# EAGLE design SG_CAN_Board_2018 (EAGLE 8.3.2)
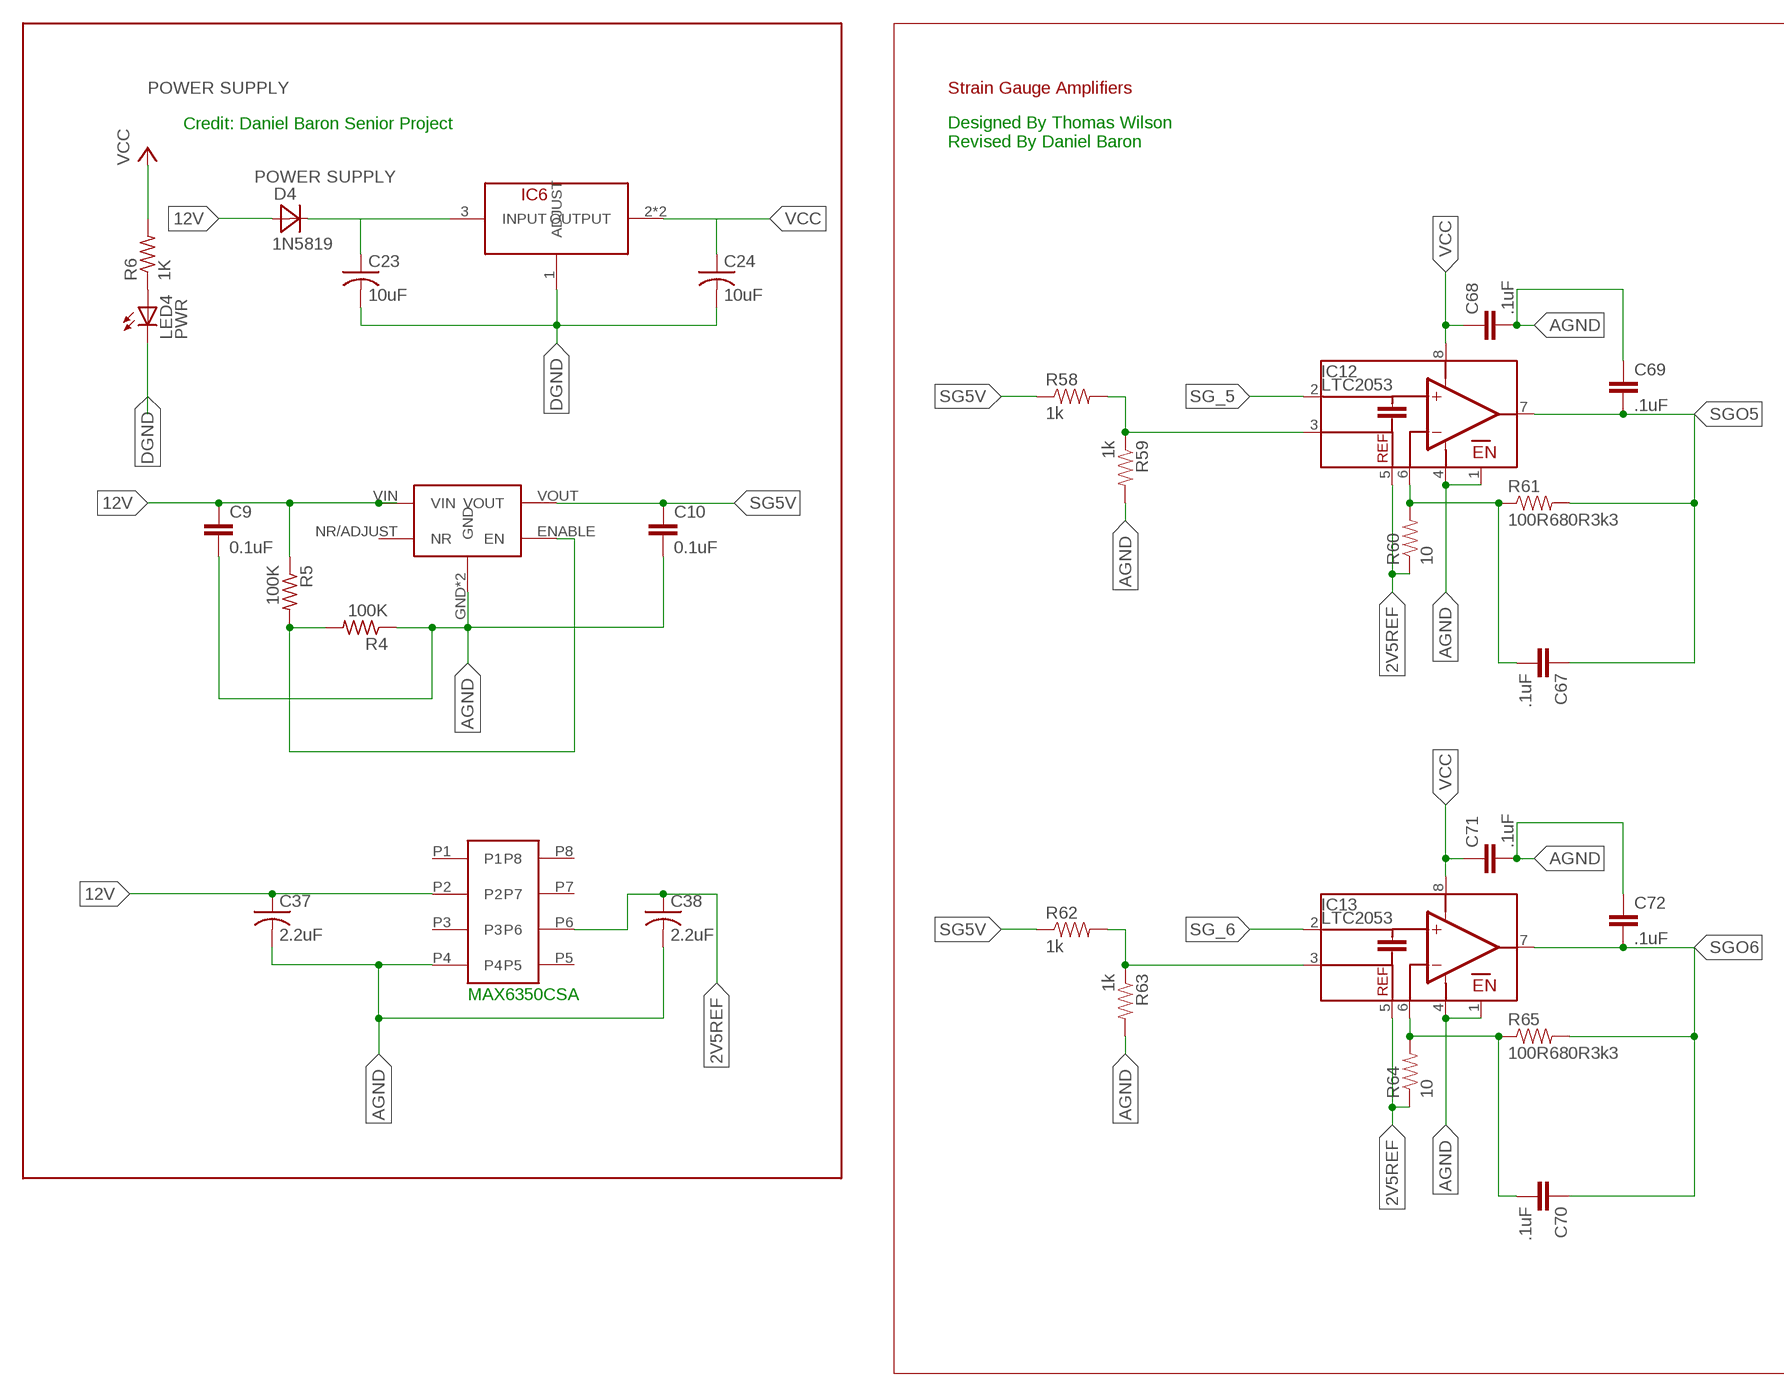
[diagram p0: schematic, sheet 1, part 1 of 2]
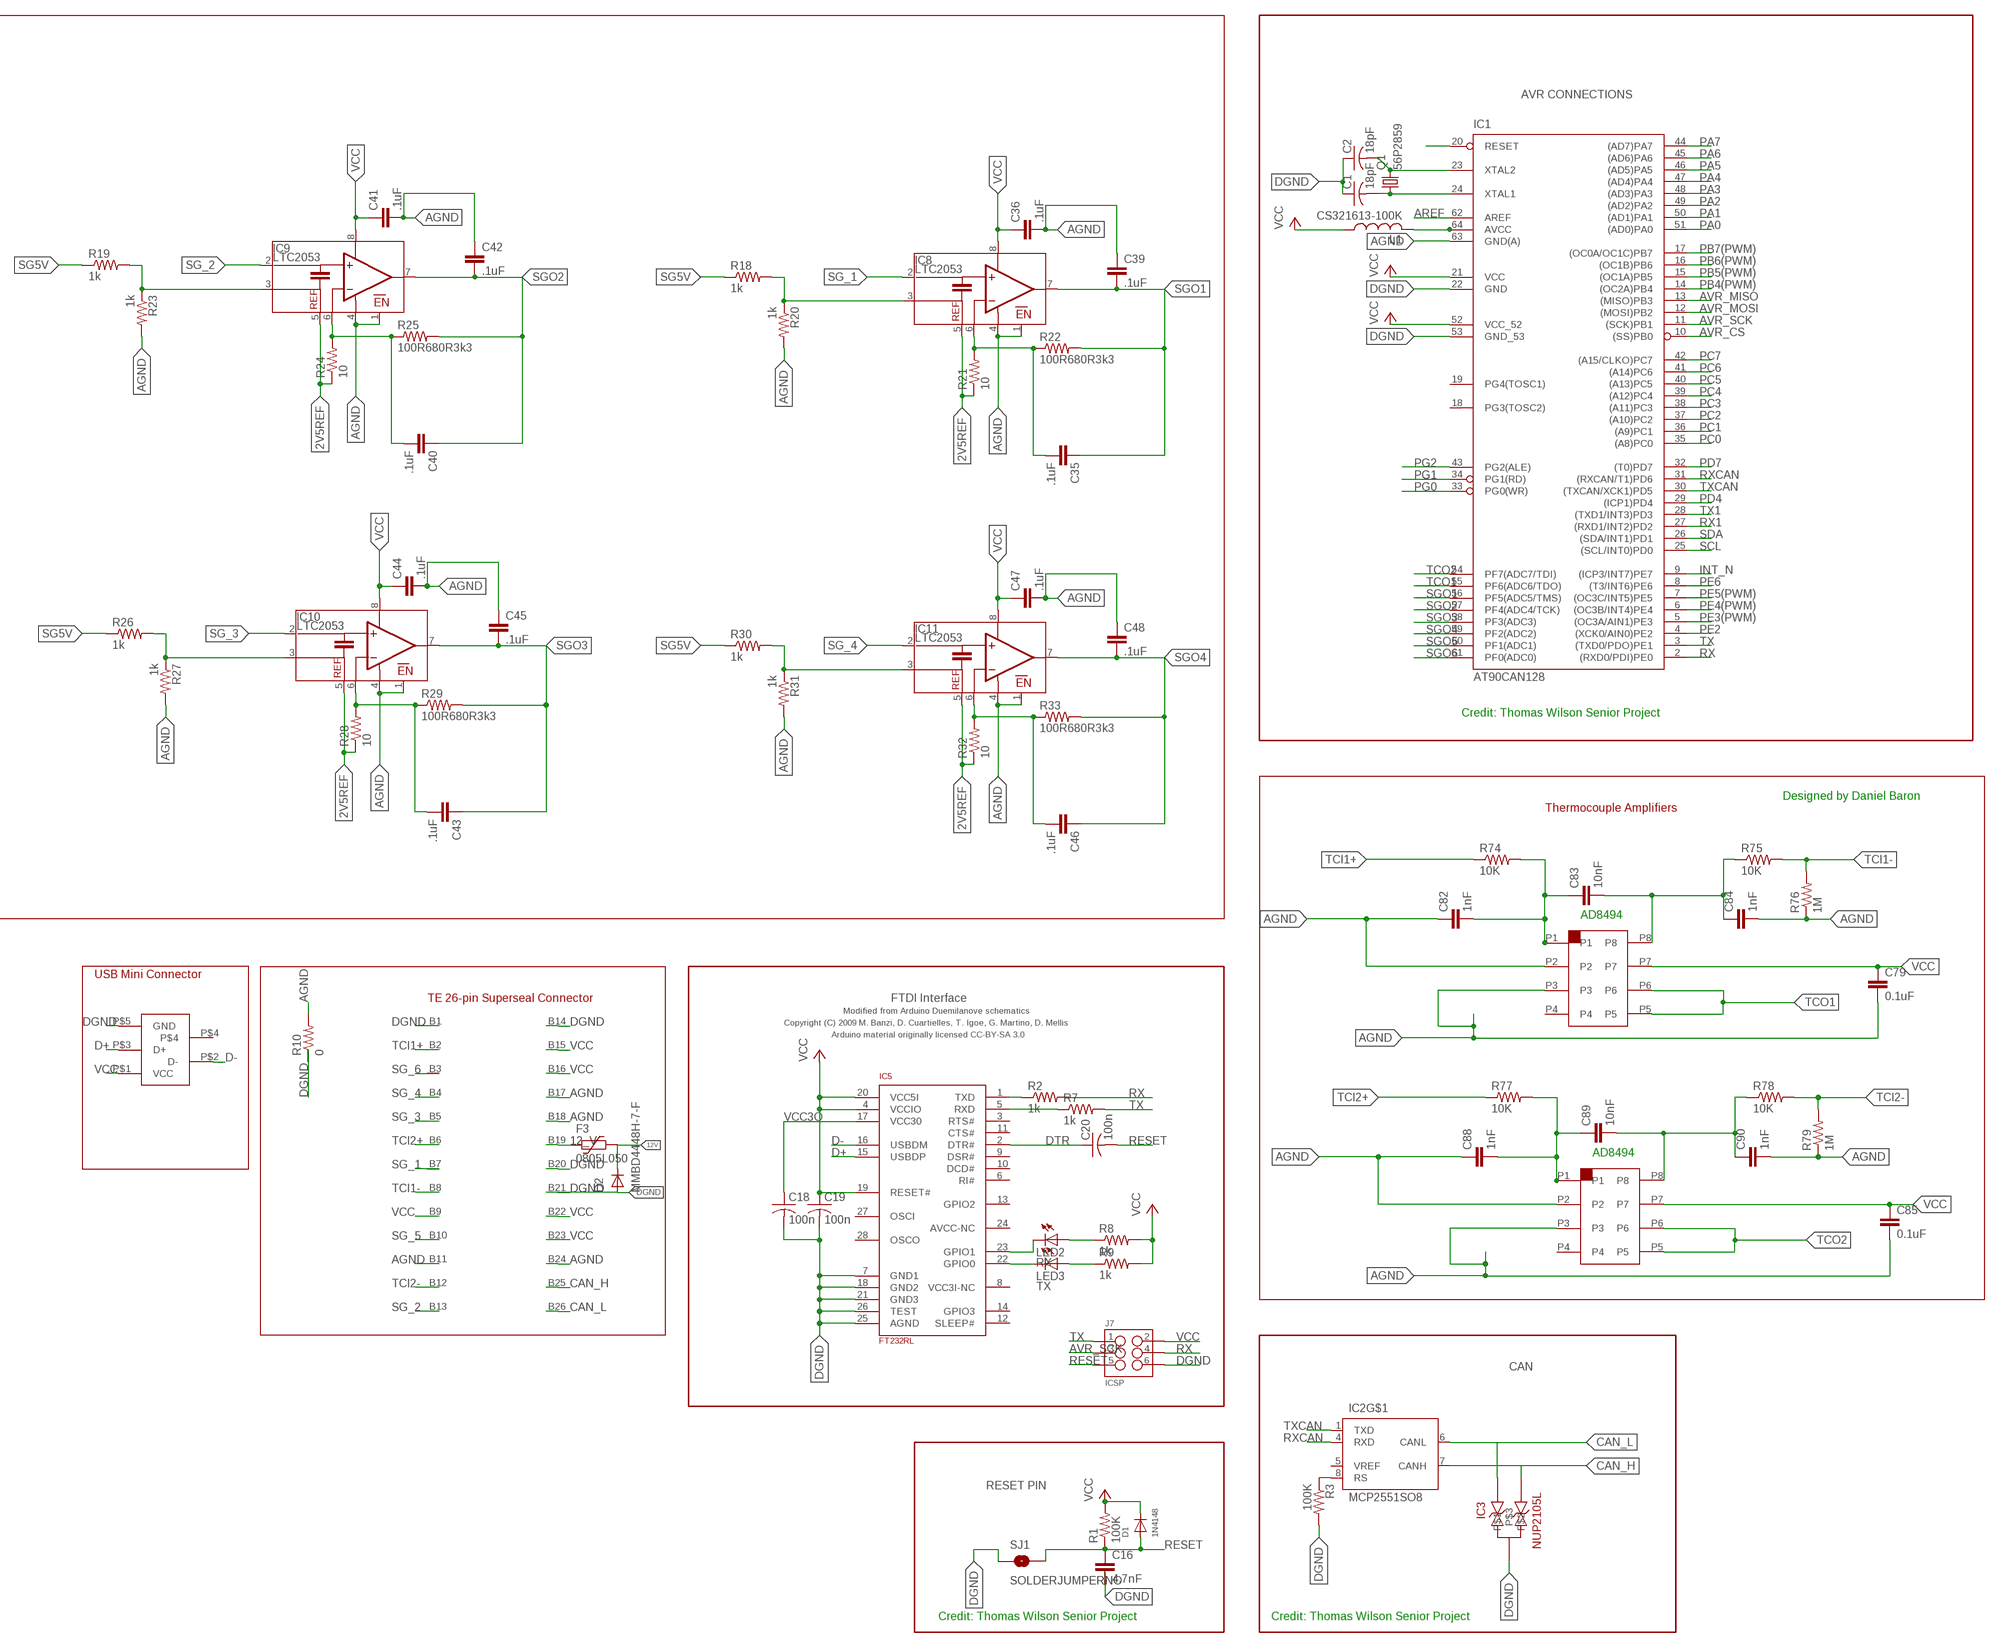
[diagram p1: schematic, sheet 1, part 2 of 2]

## Parts
C1  18pF  C-USC0805  [C0805]
C2  18pF  C-USC0805  [C0805]
C9  0.1uF  C-EUC0603  [C0603]
C10  0.1uF  C-EUC0603  [C0603]
C16  4.7nF  CAP0603-CAP  [0603-CAP]
C18  100n  C-USC0805  [C0805]
C19  100n  C-USC0805  [C0805]
C20  100n  C-USC0805  [C0805]
C23  10uF  C-USC0603  [C0603]
C24  10uF  C-USC0603  [C0603]
C35  .1uF  CAP0603-CAP  [0603-CAP]
C36  .1uF  CAP0603-CAP  [0603-CAP]
C37  2.2uF  C-USC0603  [C0603]
C38  2.2uF  C-USC0603  [C0603]
C39  .1uF  CAP0603-CAP  [0603-CAP]
C40  .1uF  CAP0603-CAP  [0603-CAP]
C41  .1uF  CAP0603-CAP  [0603-CAP]
C42  .1uF  CAP0603-CAP  [0603-CAP]
C43  .1uF  CAP0603-CAP  [0603-CAP]
C44  .1uF  CAP0603-CAP  [0603-CAP]
C45  .1uF  CAP0603-CAP  [0603-CAP]
C46  .1uF  CAP0603-CAP  [0603-CAP]
C47  .1uF  CAP0603-CAP  [0603-CAP]
C48  .1uF  CAP0603-CAP  [0603-CAP]
C67  .1uF  CAP0603-CAP  [0603-CAP]
C68  .1uF  CAP0603-CAP  [0603-CAP]
C69  .1uF  CAP0603-CAP  [0603-CAP]
C70  .1uF  CAP0603-CAP  [0603-CAP]
C71  .1uF  CAP0603-CAP  [0603-CAP]
C72  .1uF  CAP0603-CAP  [0603-CAP]
C79  0.1uF  C-EUC0603  [C0603]
C82  1nF  C-EUC0603  [C0603]
C83  10nF  C-EUC0603  [C0603]
C84  1nF  C-EUC0603  [C0603]
C85  0.1uF  C-EUC0603  [C0603]
C88  1nF  C-EUC0603  [C0603]
C89  10nF  C-EUC0603  [C0603]
C90  1nF  C-EUC0603  [C0603]
D1  1N4148  DIODESOD-123  [SOD-123]
D2  MMBD4448H-7-F  [SOT23-3]
D4  1N5819  [1N5819SM]
F3  0805L050  [0805L]
IC1  AT90CAN128  [TQFP64]
IC2  MCP2551SO8  [SO08]
IC3  NUP2105L  [SOT-23]
IC4  MAX6350CSA  [8-SOIC]
IC5  FT232RL  [SSOP28]
IC6  NCP1117  [SOT-223-4]
IC7  REG-104GA-5  [REG104GA-5]
IC8  LTC2053  [MSOP8]
IC9  LTC2053  [MSOP8]
IC10  LTC2053  [MSOP8]
IC11  LTC2053  [MSOP8]
IC12  LTC2053  [MSOP8]
IC13  LTC2053  [MSOP8]
IC15  AD8495  [8MSOP]
IC16  AD8495  [8MSOP]
J1  1734753-1_MINIUSB_CON  [1734753-1_MINIUSB_CON]
J2  SUPERSEAL1.0_26POS  [SUPERSEAL1.0_26POS]
J7  ICSP  M03X2SMD_FCI  [2X3_SMD_FCI_54202-G30]
L1  CS321613-100K  L-USL3216C  [L3216C]
LED2  RX  LEDCHIPLED_0805  [CHIPLED_0805]
LED3  TX  LEDCHIPLED_0805  [CHIPLED_0805]
LED4  PWR  LEDCHIPLED_0805  [CHIPLED_0805]
Q1  56P2859  CRYSTALSMD  [HC49UP]
R1  100K  R-US_R0805  [R0805]
R2  1k  R-US_R0805  [R0805]
R3  100K  R-US_R0805  [R0805]
R4  100K  R-US_M0805  [M0805]
R5  100K  R-US_M0805  [M0805]
R6  1K  R-US_R0805  [R0805]
R7  1k  R-US_R0805  [R0805]
R8  1k  R-US_R0805  [R0805]
R9  1k  R-US_R0805  [R0805]
R10  0  RESISTOR0603  [0603-RES]
R18  1k  RESISTOR0603  [0603-RES]
R19  1k  RESISTOR0603  [0603-RES]
R20  1k  RESISTOR0603  [0603-RES]
R21  10  RESISTOR0603  [0603-RES]
R22  100R680R3k3  RESISTOR0603  [0603-RES]
R23  1k  RESISTOR0603  [0603-RES]
R24  10  RESISTOR0603  [0603-RES]
R25  100R680R3k3  RESISTOR0603  [0603-RES]
R26  1k  RESISTOR0603  [0603-RES]
R27  1k  RESISTOR0603  [0603-RES]
R28  10  RESISTOR0603  [0603-RES]
R29  100R680R3k3  RESISTOR0603  [0603-RES]
R30  1k  RESISTOR0603  [0603-RES]
R31  1k  RESISTOR0603  [0603-RES]
R32  10  RESISTOR0603  [0603-RES]
R33  100R680R3k3  RESISTOR0603  [0603-RES]
R58  1k  RESISTOR0603  [0603-RES]
R59  1k  RESISTOR0603  [0603-RES]
R60  10  RESISTOR0603  [0603-RES]
R61  100R680R3k3  RESISTOR0603  [0603-RES]
R62  1k  RESISTOR0603  [0603-RES]
R63  1k  RESISTOR0603  [0603-RES]
R64  10  RESISTOR0603  [0603-RES]
R65  100R680R3k3  RESISTOR0603  [0603-RES]
R74  10K  RESISTOR0603  [0603-RES]
R75  10K  RESISTOR0603  [0603-RES]
R76  1M  RESISTOR0603  [0603-RES]
R77  10K  RESISTOR0603  [0603-RES]
R78  10K  RESISTOR0603  [0603-RES]
R79  1M  RESISTOR0603  [0603-RES]
SJ1  SOLDERJUMPERNO  [SJ_2S-NO]

## Nets
2V5REF: C38.1 IC4.P6 IC8.5(REF) IC9.5(REF) IC10.5(REF) IC11.5(REF) IC12.5(REF) IC13.5(REF) R21.1 R24.1 R28.1 R32.1 R60.1 R64.1
5V_REG_IN: C23.1 D4.P$2(C) IC6.3(INPUT)
12_V: F3.2 J2.B19
12V: C9.1 C37.1 D2.3(C) D4.P$1(A) F3.1 IC4.P2 IC7.VIN R5.1
AGND: C9.2 C10.2 C36.2 C37.2 C38.2 C39.1 C41.2 C42.1 C44.2 C45.1 C47.2 C48.1 C68.2 C69.1 C71.2 C72.1 C79.2 C82.1 C84.2 C85.2 C88.1 C90.2 IC1.63(GND(A)) IC4.P4 IC7.GND IC7.HEATGND(GND) IC8.1(EN) IC8.4(V-) IC9.1(EN) IC9.4(V-) IC10.1(EN) IC10.4(V-) IC11.1(EN) IC11.4(V-) IC12.1(EN) IC12.4(V-) IC13.1(EN) IC13.4(V-) IC15.P2 IC15.P3 IC16.P2 IC16.P3 J2.B11 J2.B17 J2.B18 J2.B24 R4.1 R10.2 R20.2 R23.2 R27.2 R31.2 R59.2 R63.2 R76.1 R79.1
AREF: IC1.62(AREF)
AVR_CS: IC1.10((SS)PB0)
AVR_MISO: IC1.13((MISO)PB3)
AVR_MOSI: IC1.12((MOSI)PB2)
AVR_SCK: IC1.11((SCK)PB1) J7.3
CAN_H: IC2.7(CANH) IC3.2 J2.B25
CAN_L: IC2.6(CANL) IC3.1 J2.B26
D+: IC5.15(USBDP) J1.P$3(D+)
D-: IC5.16(USBDM) J1.P$2(D-)
DGND: C1.1 C2.1 C18.2 C19.2 C23.2 C24.2 D2.1(A) IC1.22(GND) IC1.53(GND_53) IC3.3 IC5.7(GND1) IC5.18(GND2) IC5.21(GND3) IC5.25(AGND) IC5.26(TEST) IC6.1(ADJUST) J1.P$5(GND) J2.B1 J2.B14 J2.B20 J2.B21 J7.6 LED4.C R3.2 R10.1 SJ1.1
DTR: C20.1 IC5.2(DTR#)
INT_N: IC1.9((ICP3/INT7)PE7)
M8RXD: IC5.1(TXD) R2.1
M8TXD: IC5.5(RXD) R7.1
N$1: C35.2 IC8.6(RG) R21.2 R22.1
N$2: IC7.ENABLE(EN) R4.2 R5.2
N$4: IC8.3(+IN) R18.2 R20.1
N$5: IC9.3(+IN) R19.2 R23.1
N$6: IC2.8(RS) R3.1
N$7: C40.2 IC9.6(RG) R24.2 R25.1
N$8: IC10.3(+IN) R26.2 R27.1
N$9: LED4.A R6.1
N$10: C43.2 IC10.6(RG) R28.2 R29.1
N$11: C1.2 IC1.24(XTAL1) Q1.1
N$12: IC11.3(+IN) R30.2 R31.1
N$14: C46.2 IC11.6(RG) R32.2 R33.1
N$22: IC1.64(AVCC) L1.2
N$28: IC12.3(+IN) R58.2 R59.1
N$29: C67.2 IC12.6(RG) R60.2 R61.1
N$30: IC13.3(+IN) R62.2 R63.1
N$31: C70.2 IC13.6(RG) R64.2 R65.1
N$32: IC5.23(GPIO1) LED2.C
N$34: IC5.22(GPIO0) LED3.C
N$35: LED2.A R8.1
N$36: LED3.A R9.1
N$40: C88.2 C89.1 IC16.P1 R77.2
N$41: C83.2 C84.1 IC15.P8 R75.1
N$42: C89.2 C90.1 IC16.P8 R78.1
N$43: C82.2 C83.1 IC15.P1 R74.2
PA0: IC1.51((AD0)PA0)
PA1: IC1.50((AD1)PA1)
PA2: IC1.49((AD2)PA2)
PA3: IC1.48((AD3)PA3)
PA4: IC1.47((AD4)PA4)
PA5: IC1.46((AD5)PA5)
PA6: IC1.45((AD6)PA6)
PA7: IC1.44((AD7)PA7)
PB4(PWM): IC1.14((OC2A)PB4)
PB5(PWM): IC1.15((OC1A)PB5)
PB6(PWM): IC1.16((OC1B)PB6)
PB7(PWM): IC1.17((OC0A/OC1C)PB7)
PC0: IC1.35((A8)PC0)
PC1: IC1.36((A9)PC1)
PC2: IC1.37((A10)PC2)
PC3: IC1.38((A11)PC3)
PC4: IC1.39((A12)PC4)
PC5: IC1.40((A13)PC5)
PC6: IC1.41((A14)PC6)
PC7: IC1.42((A15/CLKO)PC7)
PD4: IC1.29((ICP1)PD4)
PD7: IC1.32((T0)PD7)
PE2: IC1.4((XCK0/AIN0)PE2)
PE3(PWM): IC1.5((OC3A/AIN1)PE3)
PE4(PWM): IC1.6((OC3B/INT4)PE4)
PE5(PWM): IC1.7((OC3C/INT5)PE5)
PE6: IC1.8((T3/INT6)PE6)
PG0: IC1.33(PG0(WR))
PG1: IC1.34(PG1(RD))
PG2: IC1.43(PG2(ALE))
RESET: C16.1 C20.2 D1.A IC1.20(RESET) J7.5 R1.1 SJ1.2
RX: IC1.2((RXD0/PDI)PE0) J7.4 R2.2
RX1: IC1.27((RXD1/INT2)PD2)
RXCAN: IC1.31((RXCAN/T1)PD6) IC2.4(RXD)
SCL: IC1.25((SCL/INT0)PD0)
SDA: IC1.26((SDA/INT1)PD1)
SG5V: C10.1 IC7.VOUT R18.1 R19.1 R26.1 R30.1 R58.1 R62.1
SG_1: IC8.2(-IN) J2.B7
SG_2: IC9.2(-IN) J2.B13
SG_3: IC10.2(-IN) J2.B5
SG_4: IC11.2(-IN) J2.B4
SG_5: IC12.2(-IN) J2.B10
SG_6: IC13.2(-IN) J2.B3
SGO1: C35.1 C39.2 IC1.56(PF5(ADC5/TMS)) IC8.7(OUT) R22.2
SGO2: C40.1 C42.2 IC1.57(PF4(ADC4/TCK)) IC9.7(OUT) R25.2
SGO3: C43.1 C45.2 IC1.58(PF3(ADC3)) IC10.7(OUT) R29.2
SGO4: C46.1 C48.2 IC1.59(PF2(ADC2)) IC11.7(OUT) R33.2
SGO5: C67.1 C69.2 IC1.60(PF1(ADC1)) IC12.7(OUT) R61.2
SGO6: C70.1 C72.2 IC1.61(PF0(ADC0)) IC13.7(OUT) R65.2
TCI1+: J2.B2 R74.1
TCI1-: J2.B8 R75.2 R76.2
TCI2+: J2.B6 R77.1
TCI2-: J2.B12 R78.2 R79.2
TCO1: IC1.55(PF6(ADC6/TDO)) IC15.P5 IC15.P6
TCO2: IC1.54(PF7(ADC7/TDI)) IC16.P5 IC16.P6
TX: IC1.3((TXD0/PDO)PE1) J7.1 R7.2
TX1: IC1.28((TXD1/INT3)PD3)
TXCAN: IC1.30((TXCAN/XCK1)PD5) IC2.1(TXD)
VCC: C19.1 C24.1 C36.1 C41.1 C44.1 C47.1 C68.1 C71.1 C79.1 C85.1 D1.C IC1.21(VCC) IC1.52(VCC_52) IC5.4(VCCIO) IC5.19(RESET#) IC5.20(VCC5I) IC6.2(OUTPUT) IC6.4(OUTPUT) IC8.8(V+) IC9.8(V+) IC10.8(V+) IC11.8(V+) IC12.8(V+) IC13.8(V+) IC15.P7 IC16.P7 J1.P$1(VCC) J2.B9 J2.B15 J2.B16 J2.B22 J2.B23 J7.2 L1.1 R1.2 R6.2 R8.2 R9.2
VCC3O: C18.1 IC5.17(VCC30)
XTAL1: C2.2 IC1.23(XTAL2) Q1.2
Unconnected: C16.2 IC1.18(PG3(TOSC2)) IC1.19(PG4(TOSC1)) IC2.5(VREF) IC4.P1 IC4.P3 IC4.P5 IC4.P7 IC4.P8 IC5.3(RTS#) IC5.6(RI#) IC5.8(VCC3I-NC) IC5.9(DSR#) IC5.10(DCD#) IC5.11(CTS#) IC5.12(SLEEP#) IC5.13(GPIO2) IC5.14(GPIO3) IC5.24(AVCC-NC) IC5.27(OSCI) IC5.28(OSCO) IC7.NR/ADJUST(NR) IC15.P4 IC16.P4 J1.P$4

## Notes on the sheet
- POWER SUPPLY | Strain Gauge Amplifiers
- Credit: Daniel Baron Senior Project
- Designed By Thomas Wilson
  Revised By Daniel Baron
- AVR CONNECTIONS
- POWER SUPPLY
- MAX6350CSA
- Credit: Thomas Wilson Senior Project
- Designed by Daniel Baron
- Thermocouple Amplifiers
- AD8494
- USB Mini Connector
- TE 26-pin Superseal Connector | FTDI Interface
- Modified from Arduino Duemilanove schematics
- Copyright (C) 2009 M. Banzi, D. Cuartielles, T. Igoe, G. Martino, D. Mellis
- Arduino material originally licensed CC-BY-SA 3.0
- AD8494
- CAN
- RESET PIN
- Credit: Thomas Wilson Senior Project | Credit: Thomas Wilson Senior Project

## Power pins joined to a net without a drawn wire
DGND: IC2.2(GND)
VCC: IC2.3(VCC)

## Library data of the parts
C1 C2 C18-C20 C23 C24 C37 C38 = rcl:C-US: CAPACITOR, American symbol
C9 C10 C79 C82-C85 C88-C90 = rcl:C-EU: CAPACITOR, European symbol
C16 = SparkFun-Capacitors:CAP: Capacitor Standard 0603 ceramic capacitor, and 0.1" leaded capacitor.
C35 C36 C39-C48 C67-C72 = SparkFun-Passives:CAP: Capacitor Standard 0603 ceramic capacitor, and 0.1" leaded capacitor.
D1 = adafruit:DIODE: Diode SMADIODE - SMA Surface Mount Package 20V 1A Schottky Diode Digikey: 641-1014-6-ND DO-1N4148 - Through Hole Small Current Diode SOD-123 20V 1 A (.5mV Vf) Schottky Diode - Digikey: MBRX120TPMSCT-ND SOD-323 10V 570mA (.38mV Vf, 3ns) Schottky Diode - Digikey: ZLLS410CT-ND SOD-523 30V 30mA Schottky Diode (RB751S-40TE61) - Digikey: RB751S-40TE61CT-ND SOT23-R/W - SOT23 Package (R = Solder Paste/Reflow Ovens, W = Hand-Soldering) BAT54Film 40V 300mA - Digikey: 497-7162-1-ND
D2 = diodes-inc:MMBD4448H-7-F
D4 = diode:1N5819
F3 = LittleFuse:?: Polyfuse Resettable PTC Source: http://www.littelfuse.com/products/resettable-ptcs.aspx; MF: Littelfuse; MPN: 0805L050; OC_FARNELL: 1832103; OC_NEWARK: 18M4776
IC1 = at90can128:AT90CAN128
IC2 = can:MCP2551: CAN Tranceiver Microchip
IC3 = Artificial Science:NUP2105L
IC4 = DashAndCAN library:MAX6350CSA
IC5 = SmartPrj:FT232RL
IC6 = on-semiconductor:NCP1117
IC7 = DashAndCAN library:REG-104GA-5
IC8-IC13 = linear-technology:LTC2053: DK: LTC2053CMS8#PBF-ND
IC15 IC16 = DashAndCAN library:AD8495
J1 = us-te-con:1734753-1_MINIUSB_CON
J2 = TE:SUPERSEAL1.0_26POS
J7 = SparkFun-Connectors:M03X2: 2x3 .1" header. Shrouded, with keying- CONN-10681 SMT- CONN-11415 Pogo pins- HW-11044
L1 = rcl:L-US: INDUCTOR, American symbol
LED2-LED4 = led:LED: LED OSRAM: - CHIPLED LG R971, LG N971, LY N971, LG Q971, LY Q971, LO R971, LY R971 LH N974, LH R974 LS Q976, LO Q976, LY Q976 LO Q996 - Hyper CHIPLED LW Q18S LB Q993, LB Q99A, LB R99A - SideLED LS A670, LO A670, LY A670, LG A670, LP A670 LB A673, LV A673, LT A673, LW A673 LH A674 LY A675 LS A676, LA A676, LO A676, LY A676, LW A676 LS A679, LY A679, LG A679 - Hyper Micro SIDELED® LS Y876, LA Y876, LO Y876, LY Y876 LT Y87S - SmartLED LW L88C, LW L88S LB L89C, LB L89S, LG L890 LS L89K, LO L89K, LY L89K LS L896, LA L896, LO L896, LY L896 - TOPLED LS T670, LO T670, LY T670, LG T670, LP T670 LSG T670, LSP T670, LSY T670, LOP T670, LYG T670 LG T671, LOG T671, LSG T671 LB T673, LV T673, LT T673, LW T673 LH T674 LS T676, LA T676, LO T676, LY T676, LB T676, LH T676, LSB T676, LW T676 LB T67C, LV T67C, LT T67C, LS T67K, LO T67K, LY T67K, LW E67C LS E67B, LA E67B, LO E67B, LY E67B, LB E67C, LV E67C, LT E67C LW T67C LS T679, LY T679, LG T679 LS T770, LO T770, LY T770, LG T770, LP T770 LB T773, LV T773, LT T773, LW T773 LH T774 LS E675, LA E675, LY E675, LS T675 LS T776, LA T776, LO T776, LY T776, LB T776 LHGB T686 LT T68C, LB T68C - Hyper Mini TOPLED® LB M676 - Mini TOPLED Santana® LG M470 LS M47K, LO M47K, LY M47K Source: http://www.osram.convergy.de LUXEON: - LUMILED® LXK2-PW12-R00, LXK2-PW12-S00, LXK2-PW14-U00, LXK2-PW14-V00 LXK2-PM12-R00, LXK2-PM12-S00, LXK2-PM14-U00 LXK2-PE12-Q00, LXK2-PE12-R00, LXK2-PE12-S00, LXK2-PE14-T00, LXK2-PE14-U00 LXK2-PB12-K00, LXK2-PB12-L00, LXK2-PB12-M00, LXK2-PB14-N00, LXK2-PB14-P00, LXK2-PB14-Q00 LXK2-PR12-L00, LXK2-PR12-M00, LXK2-PR14-Q00, LXK2-PR14-R00 LXK2-PD12-Q00, LXK2-PD12-R00, LXK2-PD12-S00 LXK2-PH12-R00, LXK2-PH12-S00 LXK2-PL12-P00, LXK2-PL12-Q00, LXK2-PL12-R00 Source: www.luxeon.com KINGBRIGHT: KA-3528ASYC Source: www.kingbright.com
Q1 = SparkFun-FreqCtrl:CRYSTAL: Various standard crystals. Proven footprints. Spark Fun Electronics SKU : COM-00534
R1-R9 = rcl:R-US_: RESISTOR, American symbol
R10 R18-R33 R58-R65 R74-R79 = SparkFun-Resistors:RESISTOR: Resistor Basic schematic elements and footprints for 0603, 1206, and PTH resistors.
SJ1 = SparkFun-Passives:SOLDERJUMPER: Solder Jumper Standard SMD solder jumper. Used to automate production. Two varients : Normally Open and Normally Closed are the same, but have different paste layers. NC will have a large amount of paste and should jumper during reflow.

## Board
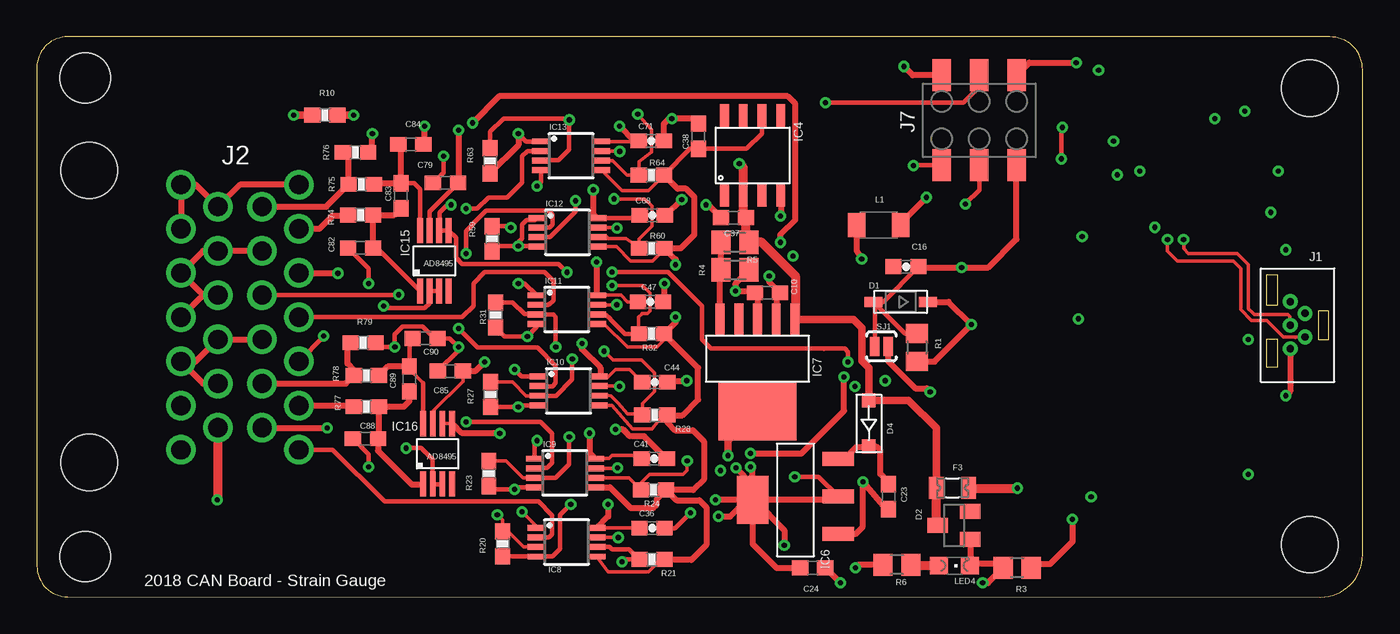
[diagram p2: board, top side]
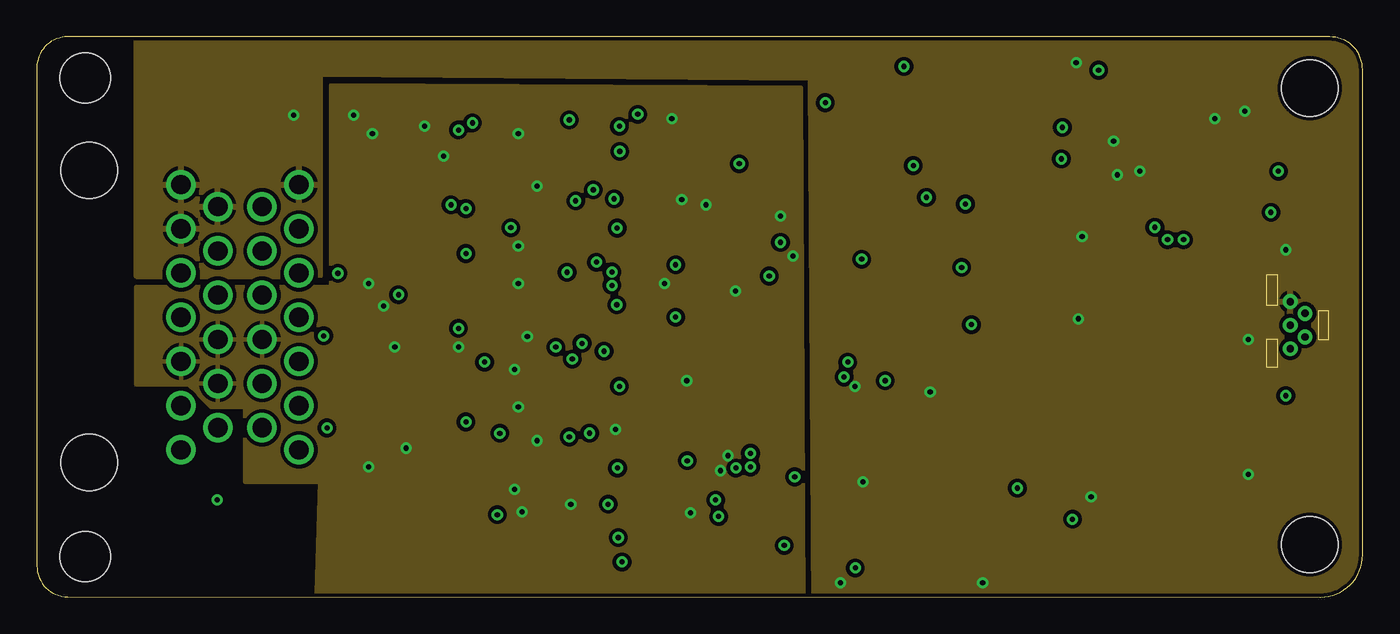
[diagram p3: board, inner layer Route6]
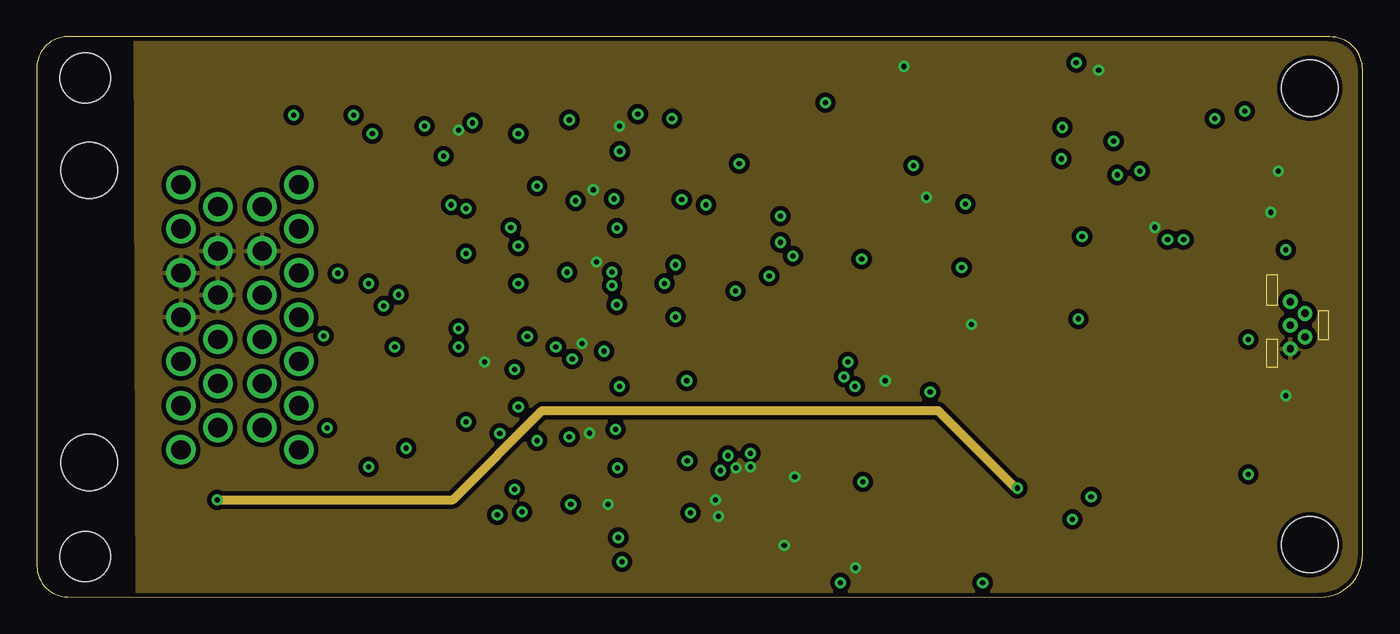
[diagram p4: board, inner layer Route11]
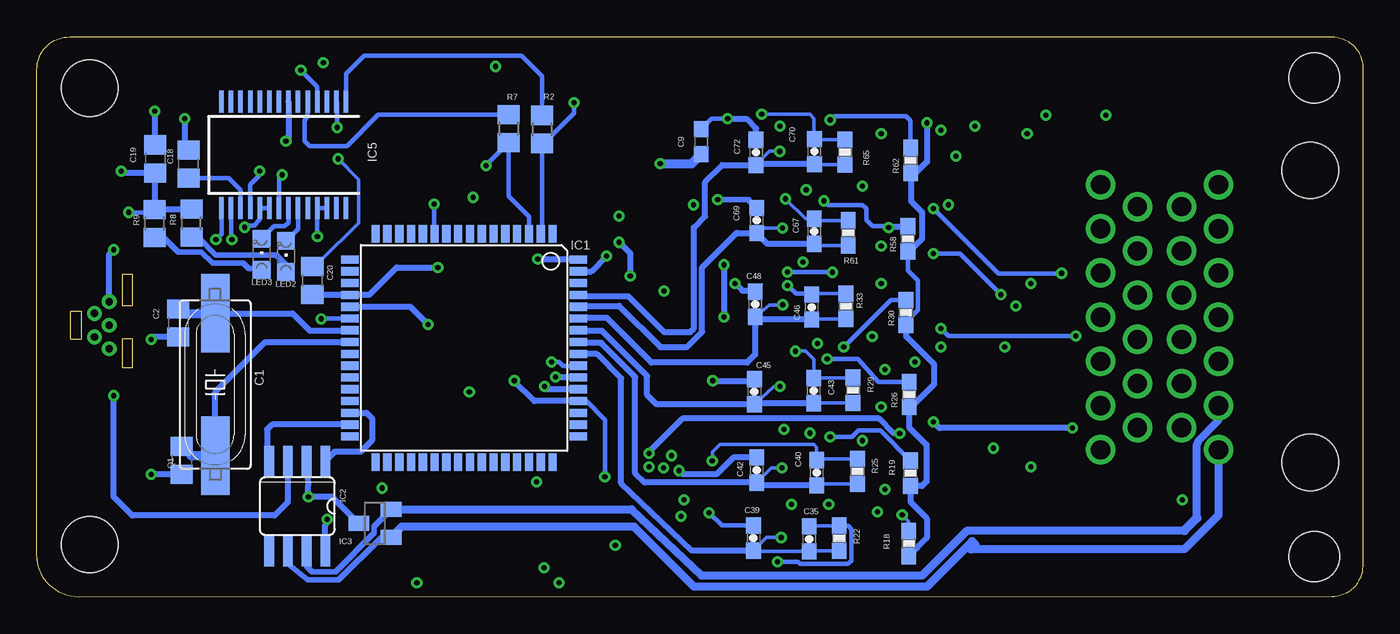
[diagram p5: board, bottom side, seen from below]

Size 89.94 x 38.02 mm. Coordinates in mm from the lower left corner, seen from the top.
Outline: 0,35.93 0,2.11 arc90 2.09,0.01 87.08,0 arc90 89.94,2.86 89.94,35.81 arc90 87.73,38.02 2.09,38.02 arc90 0,35.93
Copper layers (1*6*11*16): Top 0.053340625mm / dielectric 7.5mil / Route6 0.035559375mm / dielectric 40mil / Route11 0.035559375mm / dielectric 7.5mil / Bottom 0.053340625mm
Design rules "default *": minimum track width 6mil, minimum drill 8mil, track to track 6mil, track to pad 6mil, pad to pad 6mil, via to via 6mil, smd to smd 6mil, copper to edge 10mil, drill to drill 10mil, minimum pad ring 10mil, minimum via ring 8mil, stop-mask expansion 4mil, vias tented up to drill 0mil, thermal gap 10mil
Holes 3.81 mm at 3.56,28.96 3.56,9.14 86.36,3.56 86.36,34.54

### Footprints (pad centres in the part's own frame; a part is rotated, then mirrored left to right if it is on the bottom)
C0805 = smd 1.3 x 1.5: 1 -0.95,0; 2 0.95,0
C0603 = smd 1.1 x 1: 1 -0.85,0; 2 0.85,0
0603-CAP = smd 1.1 x 1: 1 -0.85,0; 2 0.85,0
SOD-123 = smd 1.2 x 0.7: A 1.85,0; C -1.85,0
SOT23-3 = smd 1 x 1.4: 1 -0.95,-1.1; 2 0.95,-1.1; 3 0,1.1
1N5819SM = smd 0.95 x 0.9: P$1 -1.575,0; P$2 1.575,0
0805L = smd 1 x 1.5: 1 -1.1,0; 2 1.1,0
TQFP64 = smd 1.194 x 0.559: 1 -7.76,6; 2 -7.76,5.2; 3 -7.76,4.4; 4 -7.76,3.6; 5 -7.76,2.8; 6 -7.76,2; 7 -7.76,1.2; 8 -7.76,0.4; 9 -7.76,-0.4; 10 -7.76,-1.2; 11 -7.76,-2; 12 -7.76,-2.8; 13 -7.76,-3.6; 14 -7.76,-4.4; 15 -7.76,-5.2; 16 -7.76,-6; 33 7.76,-6; 34 7.76,-5.2; 35 7.76,-4.4; 36 7.76,-3.6; 37 7.76,-2.8; 38 7.76,-2; 39 7.76,-1.2; 40 7.76,-0.4; 41 7.76,0.4; 42 7.76,1.2; 43 7.76,2; 44 7.76,2.8; 45 7.76,3.6; 46 7.76,4.4; 47 7.76,5.2; 48 7.76,6 | smd 0.559 x 1.194: 17 -6,-7.76; 18 -5.2,-7.76; 19 -4.4,-7.76; 20 -3.6,-7.76; 21 -2.8,-7.76; 22 -2,-7.76; 23 -1.2,-7.76; 24 -0.4,-7.76; 25 0.4,-7.76; 26 1.2,-7.76; 27 2,-7.76; 28 2.8,-7.76; 29 3.6,-7.76; 30 4.4,-7.76; 31 5.2,-7.76; 32 6,-7.76; 49 6,7.76; 50 5.2,7.76; 51 4.4,7.76; 52 3.6,7.76; 53 2.8,7.76; 54 2,7.76; 55 1.2,7.76; 56 0.4,7.76; 57 -0.4,7.76; 58 -1.2,7.76; 59 -2,7.76; 60 -2.8,7.76; 61 -3.6,7.76; 62 -4.4,7.76; 63 -5.2,7.76; 64 -6,7.76
SO08 = smd 0.66 x 2.032: 1 -1.905,-3.073; 2 -0.635,-3.073; 3 0.635,-3.073; 4 1.905,-3.073; 5 1.905,3.073; 6 0.635,3.073; 7 -0.635,3.073; 8 -1.905,3.073
SOT-23 = smd 1 x 1.4: 1 -0.95,-1.1; 2 0.95,-1.1; 3 0,1.1
8-SOIC = smd 0.6 x 1.55: P1 -1.905,-2.7; P2 -0.635,-2.7; P3 0.635,-2.7; P4 1.905,-2.7; P5 1.905,2.7; P6 0.635,2.7; P7 -0.635,2.7; P8 -1.905,2.7
SSOP28 = smd 0.381 x 1.499: 1 -4.225,-3.625; 2 -3.575,-3.625; 3 -2.925,-3.625; 4 -2.275,-3.625; 5 -1.625,-3.625; 6 -0.975,-3.625; 7 -0.325,-3.625; 8 0.325,-3.625; 9 0.975,-3.625; 10 1.625,-3.625; 11 2.275,-3.625; 12 2.925,-3.625; 13 3.575,-3.625; 14 4.225,-3.625; 15 4.225,3.625; 16 3.575,3.625; 17 2.925,3.625; 18 2.275,3.625; 19 1.625,3.625; 20 0.975,3.625; 21 0.325,3.625; 22 -0.325,3.625; 23 -0.975,3.625; 24 -1.625,3.625; 25 -2.275,3.625; 26 -2.925,3.625; 27 -3.575,3.625; 28 -4.225,3.625
SOT-223-4 = smd 0.95 x 2.15: 1 -2.3,-2.9; 2 0.24,-2.9; 3 2.78,-2.9 | smd 3.25 x 2.15: 4 0,2.9
REG104GA-5 = smd 0.6 x 2.2: ENABLE 2.54,-6.2; GND 0,-6.2; NR/ADJUST 1.27,-6.2; VIN -2.54,-6.2; VOUT -1.27,-6.2 | smd 5.3 x 4: HEATGND 0,0
MSOP8 = smd 0.4 x 1.2: 1 -0.975,-2.05; 2 -0.325,-2.05; 3 0.325,-2.05; 4 0.975,-2.05; 5 0.975,2.05; 6 0.325,2.05; 7 -0.325,2.05; 8 -0.975,2.05
8MSOP = smd 0.4 x 1.7: P1 -0.975,-2.05; P2 -0.325,-2.05; P3 0.325,-2.05; P4 0.975,-2.05; P5 0.975,2.05; P6 0.325,2.05; P7 -0.325,2.05; P8 -0.975,2.05
1734753-1_MINIUSB_CON = drill 0.5: P$1 -0.5,-1.6; P$2 0.5,-0.8; P$3 -0.5,0; P$4 0.5,0.8; P$5 -0.5,1.6
SUPERSEAL1.0_26POS = drill 1.3 pad 2: B1 -9.17,4.73; B2 -6.17,4.73; B3 -3.17,4.73; B4 -0.17,4.73; B5 2.83,4.73; B6 5.83,4.73; B7 8.83,4.73; B8 -7.67,2.23; B9 -4.67,2.23; B10 -1.67,2.23; B11 1.33,2.23; B12 4.33,2.23; B13 7.33,2.23; B14 -7.67,-0.77; B15 -4.67,-0.77; B16 -1.67,-0.77; B17 1.33,-0.77; B18 4.33,-0.77; B19 7.33,-0.77; B20 -9.17,-3.27; B21 -6.17,-3.27; B22 -3.17,-3.27; B23 -0.17,-3.27; B24 2.83,-3.27; B25 5.83,-3.27; B26 8.83,-3.27 | hole 3.4: -16.42,-9.77; 16.08,-9.77
2X3_SMD_FCI_54202-G30 = smd 1.27 x 2.18: 1 -2.54,-3.05; 2 -2.54,3.05; 3 0,-3.05; 4 0,3.05; 5 2.54,-3.05; 6 2.54,3.05
L3216C = smd 1.2 x 1.6: 1 -1.5,0; 2 1.5,0
CHIPLED_0805 = smd 1.2 x 1.2: A 0,-1.05; C 0,1.05
HC49UP = smd 5.334 x 1.93: 1 -4.826,0; 2 4.826,0
R0805 = smd 1.3 x 1.5: 1 -0.95,0; 2 0.95,0
M0805 = smd 1.3 x 1.6: 1 -0.95,0; 2 0.95,0
0603-RES = smd 1.1 x 1: 1 -0.85,0; 2 0.85,0
SJ_2S-NO = smd 0.635 x 1.27: 1 -0.45,0; 2 0.45,0

### Placement (x,y rotation side)
C1  80.12,9.28 90 bottom
C2  80.35,18.6 90 bottom
C9  44.87,30.9 90 bottom
C10  49.57,20.66 180 top
C16  58.96,22.43 180 top
C18  79.65,29.39 90 bottom
C19  81.91,29.74 90 bottom
C20  71.25,21.49 270 bottom
C23  57.77,6.82 270 top
C24  52.63,1.98 0 top
C35  37.54,3.95 90 bottom
C36  41.74,4.68 0 top
C37  47.27,25.75 180 top
C38  44.88,31.27 90 top
C39  41.33,4 270 bottom
C40  37.04,8.44 90 bottom
C41  41.88,9.39 0 top
C42  41.11,8.62 270 bottom
C43  37.23,14 90 bottom
C44  41.92,14.59 0 top
C45  41.27,13.94 270 bottom
C46  37.38,19.68 90 bottom
C47  41.63,20.04 0 top
C48  41.22,19.87 270 bottom
C67  37.2,24.82 90 bottom
C68  41.75,25.91 0 top
C69  41.11,25.56 270 bottom
C70  37.19,30.23 90 bottom
C71  41.69,30.96 0 top
C72  41.15,30.18 270 bottom
C79  27.72,28.11 180 top
C82  21.96,23.7 0 top
C83  24.71,27.24 90 top
C84  25.38,30.73 0 top
C85  28.05,15.35 180 top
C88  22.29,10.76 0 top
C89  25.28,14.8 90 top
C90  26.34,17.56 0 top
D1  58.6,20.03 180 top
D2  62.22,4.86 90 top
D4  56.44,11.79 270 top
F3  62.12,7.42 0 top
IC1  60.96,16.91 270 bottom
IC2  72.28,6.17 180 bottom
IC3  67.01,5.01 90 bottom
IC4  48.56,29.97 0 top
IC5  73.2,30.01 180 bottom
IC6  51.47,6.59 90 top
IC7  48.89,12.63 180 top
IC8  35.93,3.73 270 top
IC9  35.82,8.42 270 top
IC10  36.07,13.99 270 top
IC11  35.95,19.51 270 top
IC12  36,24.75 270 top
IC13  36.25,29.95 270 top
IC15  26.97,22.82 0 top
IC16  27.19,9.72 0 top
J1  85.53,18.45 0 top
J2  13.05,18.82 270 top
J7  63.93,32.36 0 top
L1  57.11,25.25 180 top
LED2  73.04,23.12 0 bottom
LED3  74.69,23.27 0 bottom
LED4  62.25,2.13 270 top
Q1  77.84,14.43 90 bottom
R1  59.7,16.94 270 top
R2  55.67,31.74 270 bottom
R3  66.5,1.99 180 top
R4  47.37,22.21 180 top
R5  47.36,24.09 180 top
R6  58.35,2.2 180 top
R7  57.95,31.79 270 bottom
R8  79.45,25.38 90 bottom
R9  81.94,25.35 90 bottom
R10  19.55,32.71 0 top
R18  30.79,3.63 90 bottom
R19  30.68,8.4 90 bottom
R20  31.6,3.62 270 top
R21  41.73,2.56 180 top
R22  35.51,3.99 270 bottom
R23  30.67,8.38 270 top
R24  41.84,7.28 180 top
R25  34.28,8.52 270 bottom
R26  30.77,13.75 90 bottom
R27  30.77,13.75 270 top
R28  41.92,12.36 180 top
R29  34.57,14.03 270 bottom
R30  30.98,19.31 90 bottom
R31  31.11,19.15 270 top
R32  41.71,17.87 180 top
R33  35.06,19.74 270 bottom
R58  30.86,24.32 90 bottom
R59  30.89,24.32 270 top
R60  41.72,23.68 180 top
R61  34.89,24.72 270 bottom
R62  30.67,29.64 90 bottom
R63  30.75,29.61 270 top
R64  41.69,28.64 180 top
R65  35.12,30.2 270 bottom
R74  21.96,25.93 0 top
R75  22.01,28.02 180 top
R76  21.62,30.17 180 top
R77  22.36,12.93 0 top
R78  22.35,15.04 180 top
R79  22.14,17.26 180 top
SJ1  57.3,17.01 180 top

### Tracks (layer width: path | path; a pad name or v marks a point on that pad's centre or on a via)
2V5REF  (via drill 0.35)
  Top 0.254: IC10.5 39.01,13.02 40.42,11.41 41.73,11.41 42.48,12.36 R28.1 | 42.39,23.42 42.53,23.42 R60.1 | 42.39,23.42 42.28,23.42 | 42.29,2.56 R21.1 | 42.32,2.56 41.5,1.73 38.75,1.73 IC8.5 | IC13.5 38.32,28.98 39.71,27.58 41.5,27.58 42.01,28.09 42.01,28.11 R64.1 | IC11.5 38.49,18.54 40.06,16.97 42.06,16.97 42.56,17.46 R32.1 | 42.39,23.42 41.78,22.81 40.28,22.81 39.32,23.78 IC12.5
  Top 0.305: R21.1 42.32,2.56 | IC4.P6 49.2,31.47 48.15,30.42 C38.1 44.32,30.42 R64.1
  Top 0.406: 42.54,28.4 R64.1 | 42.55,23.41 42.53,23.42 | R24.1 42.7,7.26 44.53,7.26 45.25,7.99 45.25,10.58 44.5,11.33 43.31,11.33 42.77,11.86 R28.1 42.79,12.34 43.79,12.34 44.86,13.41 44.86,15.57 R32.1 | R21.1 42.62,2.51 44.4,2.51 45.43,3.54 45.43,6.1 44.95,6.58 43.39,6.58 R24.1 | IC9.5 38.88,7.45 40.28,6.04 41.81,6.04 42.06,6.3 42.06,6.65 R24.1 | R60.1 42.72,23.42 | 42.63,23.74 R60.1 | R64.1 42.54,28.88 | R60.1 | R60.1 43.69,23.68 44.6,24.59 44.6,27.16 44.06,27.71 43.48,27.71 R64.1 | R32.1 | R32.1 42.56,17.97 | R60.1 42.57,23.57 | R32.1 43.33,18.64 v43.33,19 | R60.1 43.33,22.91 v43.33,22.55
  Bottom 0.406: v43.33,22.55 v43.33,19
5V_REG_IN
  Top 0.406: C23.1 57.77,7.81 57.23,8.36 57.23,9.93 56.95,10.21 D4.P$2 | 54.54,9.54 IC6.3 54.78,9.37 55.6,10.18 56.41,10.18 D4.P$2 | D4.P$2
12_V  (via drill 0.35)
  Top 0.305: F3.2 63.25,7.39
  Top 0.61: J2.B19 12.28,6.64 v12.24,6.6 | 63.25,7.39 v66.52,7.39
  Route11 0.61: 64.28,9.52 63.8,9.99 | 64.28,9.52 66.42,7.38 66.42,7.37 v66.52,7.39 | v12.24,6.6 28.23,6.6 34.29,12.66 61.14,12.66 64.28,9.52
12V  (via drill 0.35)
  Top 0.508: F3.1 61.02,11.47 59.13,13.36 D4.P$1 | D4.P$1 56.44,15.54 55.97,16.01 55.97,18.26 55.41,18.83 54.51,18.83 | IC7.VIN 54.51,18.83 | 54.51,18.83 54.87,18.83
  Top 0.61: F3.1 61.02,4.96 D2.3 | 56.38,13.29 D4.P$1 | IC7.VIN 51.46,18.85 51.46,21.79 49.17,24.09 R5.1 48.12,24.28 C37.1 47.93,25.94 IC4.P2 47.93,29.14 v47.65,29.41
  Bottom 0.61: v47.65,29.41 45.51,29.41 C9.1
AGND  (via drill 0.35)
  Top 0.254: IC13.4 | IC11.4 | 34.01,13 IC10.4 | 33.81,4.77 IC8.1 33.88,4.83 v32.92,5.79 | 33.76,9.41 IC9.1 | 42.61,4.7 C36.2
  Top 0.305: 26.21,30.74 C84.2 | 31.42,2.77 R20.2 34.17,2.77 34.19,2.75 | IC16.P3 27.53,7.65 26.88,7.65 IC16.P2 26.84,7.7 26.84,9.35 26.07,10.11 v25.04,10.11 | 42.33,4.68 C36.2 43.3,4.68 v44.34,5.71 | 33.86,2.77 IC8.4 | IC13.1 33.18,30.93 v32.66,31.44 | 33.91,2.72 IC8.4 | 30.67,23.69 R59.2 | R59.2 30.89,23.72 | IC15.P3 IC15.P2 26.64,19.94 26.32,19.62 23.66,19.62 v23.52,19.76 | IC13.4 34.2,28.15 v33.93,27.89 | IC12.1 33.81,25.58 33.23,25.58 32.92,25.27 32.92,24.33 32.66,24.08 v32.66,23.82 | IC12.4 33.91,23.82 v32.66,23.82 | R59.2 31.25,23.82 v32.66,23.82 | IC11.1 33.1,21.28 v32.66,21.28 | R31.2 31.72,17.69 v33.27,17.69 33.9,18.32 IC11.4 | R27.2 v32.66,12.9 32.78,13.02 IC10.4 | IC10.1 32.88,14.97 v32.41,15.44 | IC9.1 33.77,10.45 v33.93,10.62 | IC9.4 32.54,7.45 v32.41,7.31 30.89,7.31 R23.2 | C88.1 22.5,9.7 v22.5,8.84 | C85.2 28.6,16.75 v28.6,16.97 28.01,17.56 C90.2 26.97,17.56 26.17,18.36 24.82,18.36 24.3,17.84 24.27,17.84 24.27,17.03 24.21,16.97 | R79.1 23.28,16.97 24.21,16.97 | 24.21,16.97 v24.28,16.97 | 22.5,30.21 R76.1 | C79.2 27.58,28.82 v27.58,29.92 | C82.1 22.5,22.3 v22.5,21.28 | 34.19,2.75 IC8.4 | 34.19,2.75 34.98,2.75 34.98,2.78 35.5,3.29 35.5,5.57 v36.22,6.3 | C38.2 44.55,32.46
  Top 0.406: 20.91,23.49 C82.1 | C71.2 42.55,32.12 42.89,32.46 v43.08,32.46 44.55,32.46 | R63.2 32.66,30.67 v32.66,31.44 | J2.B18 11.28,14.49 9.81,15.96 | 9.81,15.96 J2.B24 | 9.81,15.96 10.75,15.96 J2.B17 J2.B11 | C41.2 41.2,10.92 40.4,10.92 40.22,10.93 40.21,10.94 40.19,10.95 40.07,11.08 39.94,11.21 39.79,11.38 v39.27,11.38 | C68.2 42.69,25.91 v43.75,26.97 | IC4.P4 50.47,25.88 v50.44,25.86 | C37.2 45.55,26.62 v45.39,26.62 | R76.1 22.76,30.47 v22.76,31.44 | C47.2 42.57,20.13 v42.57,21.28 | C84.2 26.31,30.81 v26.31,31.95 | 48.32,21.96 R4.1 47.43,21.31 47.43,21.26 47.4,21.23 v47.4,20.78 48.59,20.78 C10.2 48.89,20.48 IC7.GND | C44.2 42.86,14.68 v44.09,14.68
  Top 0.508: IC7.HEATGND 46.89,10.62 v46.89,9.6 | R10.2 v21.49,32.71
  Bottom 0.305: IC1.63 | C72.1 41.04,30.91 | C39.1 43.47,4.85 v44.34,5.71 | C9.2 44.17,32.46 v43.08,32.46
  Bottom 0.406: C69.1 41.65,26.95 v43.75,26.97 | C72.1 41.15,31.81 41.81,32.46 v43.08,32.46 | 41.41,14.93 C45.1 41.37,14.68 v44.09,14.68 | C42.1 42.7,9.47 43.84,8.33 46.13,8.33 v46.38,8.58 | 41.28,20.79 41.52,21.03 | 41.28,20.79 C48.1 | IC1.63 52.33,22.11 v51.29,23.15 | v42.57,21.28 42.08,20.79 41.28,20.79
  pour Route6 (isolate 0.254): 51.84,34.57 19.96,34.75 19.96,21.03 6.76,21.03 6.76,14.43 10.31,14.43 11.84,12.9 14.12,12.9 14.12,7.82 19.2,7.82 18.95,-0.81 52.01,-0.86
AVR_SCK  (via drill 0.35)
  Top 0.305: J7.3 63.93,27.63 62.99,26.69 v62.99,26.67
  Bottom 0.305: v62.99,26.67 62.99,24.7 IC1.11
CAN_H
  Bottom 0.381: IC2.7 71.64,2.1 71.27,1.73 69.69,1.73 67.05,4.36 67.05,4.81 IC3.2
  Bottom 0.508: 11.24,10.36 11.19,10.41 11.19,10.58 9.78,11.98 J2.B25
  Bottom 0.559: IC3.2 49.59,5.96 44.86,1.47 29.87,1.47 26.82,4.52 12.09,4.52 | 11.24,5.37 11.24,10.36
  Bottom 0.61: 12.09,4.52 11.24,5.37
CAN_L
  Bottom 0.381: IC3.1 66.57,4.06 69.46,1.17 71.56,1.17 72.84,2.19 72.84,3.28
  Bottom 0.406: 72.84,3.28 IC2.6
  Bottom 0.559: J2.B26 9.78,5.56 12.09,3.25 26.57,3.25 | 26.51,3.76 29.55,0.71 45.36,0.71 49.43,4.77 65.19,4.77 IC3.1
  Bottom 0.61: 26.57,3.25 26.28,3.54 26.51,3.76
D+  (via drill 0.35)
  Top 0.254: 82.25,19.53 82.23,19.53 | J1.P$3 85,18.49 85,19.04 84.85,19.19 82.59,19.19 82.25,19.53 | v77.8,24.26 77.8,23.65 78.13,23.32 81.43,23.32 82.19,22.55 82.19,19.57 82.23,19.53 | 82.23,19.53 82.25,19.53
  Bottom 0.305: IC5.15 77.42,24.64 v77.8,24.26
D-  (via drill 0.35)
  Top 0.254: 85.36,17.64 84.57,17.64 83.43,18.78 82.41,18.78 81.69,19.5 81.69,22.3 81.18,22.81 77.37,22.81 76.71,23.47 v76.71,24.26 | 85.36,17.64 85.37,17.63 | 85.36,17.64 86.02,17.64 J1.P$2
  Bottom 0.305: IC5.16 76.77,24.32 v76.71,24.26
DGND  (via drill 0.35)
  Top 0.305: 63.32,2.15 63.32,2.16 63.4,2.24
  Top 0.406: 63.32,2.15 LED4.C | C23.2 57.64,5.96 v56.03,7.82 56.03,4.77 55.52,4.27 54.39,4.27 IC6.1 54.34,4.27 | J2.B1 13.78,27.99 J2.B14 10.78,27.99 J2.B20 J2.B21 | J7.6 67.33,36.27 v70.51,36.27 | D2.1 63.32,2.33 63.4,2.24 65.3,2.24 R3.2 64.53,0.96 v64.16,0.96 | SJ1.1 57.75,16.01 59.59,14.17 60.35,14.17 v60.6,13.92 | C24.2 53.49,1.98 v54.51,0.96
  Top 0.508: R10.1 v17.42,32.71
  Top 0.61: IC6.1 54.41,4.33
  Bottom 0.305: 53.21,14.1 IC1.53 | IC5.26 IC5.25 v70.92,24.48 v70.92,24.47 | IC5.18 75.47,28.01 74.83,28.65 v74.83,28.9 | IC1.22 70.63,18.91 v70.65,18.88 | IC5.21 73.52,28.43 v73.3,28.65
  Bottom 0.406: J1.P$5 85.03,23.27 v84.73,23.57 | IC1.53 55.32,14.11 v55.5,14.29 | C18.2 79.91,30.59 v79.91,32.46 | IC5.7 72.87,31.12 v73.05,30.94 | C2.1 82.02,17.65 v82.19,17.47 | C1.1 v82.19,8.33 | C19.2 81.91,32.93 v81.94,32.97 | IC2.2 71.53,7.59 v71.53,6.81 69.91,6.81 IC3.3
  pour Route6 (isolate 0.254): 6.76,21.79 19.2,21.79 19.2,35.51 52.48,35.25 52.73,-0.81 90.83,-0.81 90.83,38.56 6.76,38.56
DTR  (via drill 0.35)
  Top 0.305: v69.5,29.74 69.49,31.8 v69.57,31.88
  Bottom 0.254: 71.25,22.8 70.71,22.8 68.11,25.4 68.11,28.35 v69.5,29.74
  Bottom 0.305: C20.1 71.25,22.8 | v69.57,31.88 69.57,33.59 IC5.2
M8RXD
  Bottom 0.305: R2.1 55.67,35.35 57.06,36.74 67.74,36.74 68.96,35.52 IC5.1
M8TXD
  Bottom 0.305: R7.1 66.78,32.74 68.91,30.61 71.45,30.61 71.78,30.94 71.78,32.38 71.56,32.6 IC5.5
N$1  (via drill 0.35)
  Top 0.305: v39.7,2.39 39.87,2.56 R21.2 40.19,3.25 39.01,3.25 38.86,3.4 IC8.6
  Bottom 0.254: R22.1 37.49,4.84 C35.2
  Bottom 0.305: 39.65,2.39 v39.7,2.39 38.31,2.39 38.17,2.24 34.91,2.24 34.68,2.46 34.68,4.58 34.67,4.6 34.9,4.83 35.49,4.83 R22.1
N$2
  Top 0.406: IC7.ENABLE 46.35,22.14 R4.2 46.42,24.08 R5.2
N$4  (via drill 0.35)
  Top 0.254: IC8.3 33.02,3.4 31.96,4.47 R20.1 31.6,5.23 v31.24,5.59
  Bottom 0.254: 30.81,4.5 30.81,5.16 v31.24,5.59
  Bottom 0.305: v31.24,5.59 31.22,5.59 | R18.2 30.81,4.5
N$5  (via drill 0.35)
  Top 0.254: R23.1 31.84,9.23 32.97,8.1 IC9.3
  Top 0.305: v36.12,10.87 36.12,9.02 35.2,8.1 IC9.3
  Bottom 0.305: 31.05,9.25 R19.2 32.72,11.3 34.22,11.3 34.65,10.87 v36.12,10.87 36.22,10.97
N$6  (via drill 0.35)
  Top 0.406: v70.26,5.28 70.26,3.76 68.73,2.23 67.7,2.23 R3.1
  Bottom 0.406: 70.51,2.98 IC2.8 70.37,4.91 70.26,5.03 v70.26,5.28
N$7  (via drill 0.35)
  Top 0.254: IC9.6 40.17,8.1 R24.2 | R24.2 41.28,7.28 | R24.2 40.99,7.76 41.55,8.33 43.84,8.33 44.09,8.58 44.09,9.22 v44.12,9.25
  Bottom 0.254: 36.96,9.37 R25.1 | 36.96,9.37 C40.2 37.04,10.17 37.24,10.36 43.59,10.36 44.09,9.85 44.09,9.3 44.13,9.26 v44.12,9.25 | 37.03,9.45 36.96,9.37
N$8  (via drill 0.35)
  Top 0.254: R27.1 32.26,14.6 33.2,13.66 IC10.3
  Top 0.305: v36.32,16.15 36.32,14.76 35.23,13.66 IC10.3
  Bottom 0.305: R26.2 32.84,14.6 34.25,16.15 36.3,16.16 v36.32,16.15
N$9
  Top 0.61: LED4.A 59.37,2.13 R6.1
N$10  (via drill 0.35)
  Top 0.254: v38.48,16.69 39.07,16.09 41.01,16.09 41.9,15.2 41.9,13.97 41.07,13.15 R28.2 41.01,12.43 40.07,12.43 39.41,13.17 39.41,13.19 39.3,13.3 39.2,13.41 39.18,13.41 38.94,13.66 38.76,13.67 IC10.6
  Bottom 0.254: 37.19,14.88 R29.1 | 37.19,14.88 37.2,14.88 C43.2 | v38.48,16.69 37.8,16.69 37.24,16.13 37.24,14.93 37.19,14.88
N$11
  Bottom 0.406: 77.84,10.87 Q1.1 77.84,13.91 74.45,17.31 IC1.24 68.74,17.28
  Bottom 0.61: Q1.1 79.49,9.6 C1.2
N$12  (via drill 0.35)
  Top 0.254: IC11.3 33.89,19.18
  Top 0.305: R31.1 32.27,20 33.07,19.2 33.86,19.2 33.89,19.18 | v35.2,16.97 35.2,19 35.04,19.16 33.92,19.16 IC11.3
  Bottom 0.305: R30.2 32.01,20.16 v35.2,16.97
N$14  (via drill 0.35)
  Top 0.254: v39.01,21.15 41.11,21.15 41.61,20.65 41.61,19.42 41.44,19.26 41.05,19.26 41.05,19.25 41.05,19.23 40.82,19 40.82,17.88 40.81,17.87
  Top 0.305: IC11.6 38.58,19.19 38.9,18.86 38.9,18.85 39.89,17.87 40.81,17.87 R32.2
  Bottom 0.254: 37.32,20.59 R33.1
  Bottom 0.305: 37.32,20.59 38.45,20.59 v39.01,21.15
  Bottom 0.406: C46.2 37.32,20.59
N$22  (via drill 0.35)
  Top 0.305: L1.2 55.61,25.2
  Top 0.406: 55.61,25.2 55.61,23.5 v55.96,22.94
  Bottom 0.406: v55.96,22.94 53.23,22.94 IC1.64
N$28  (via drill 0.35)
  Top 0.254: IC12.3
  Top 0.305: IC12.3 34.82,24.43 36.55,26.16 v36.55,26.9 | R59.1 32.31,25.17 v32.16,25.07
  Bottom 0.305: v32.16,25.07 30.95,25.07 R58.2 33.24,25.17 33.68,25.6 33.68,26.36 33.93,26.62 36.28,26.62 v36.55,26.9
N$29  (via drill 0.35)
  Top 0.254: IC12.6 38.67,24.43 38.76,24.33 39.96,24.33 R60.2 40.87,24.31 41.73,25.17 41.73,25.2 41.73,26.53 41.24,27.02 v39.17,27.02
  Bottom 0.254: R61.1 37.1,25.57 C67.2 | 37.19,25.69 C67.2 | C67.2 37.81,25.67 v39.17,27.02
N$30  (via drill 0.35)
  Top 0.254: 34.18,29.64 IC13.3
  Top 0.305: IC13.3 34.21,29.64 35.38,29.64 36.12,30.38 v36.12,32.38 36.02,32.49 31.65,32.49 30.75,31.59 R63.1
  Bottom 0.305: R62.2 30.67,32.32 30.99,32.64 35.86,32.64 v36.12,32.38
N$31  (via drill 0.35)
  Top 0.254: v40.77,32.77 41.69,31.73 41.69,30.19 40.84,29.55 R64.2 40.83,28.65 40.03,28.65 39.05,29.63 IC13.6
  Bottom 0.254: R65.1 37.16,31.05 C70.2 37.21,31.1 37.21,32.49 37.49,32.77 v40.77,32.77
N$32
  Bottom 0.305: IC5.23 72.22,24.99 LED2.C
N$34
  Bottom 0.305: IC5.22 72.87,25.43 73.13,25.17 73.83,25.17 LED3.C
N$35
  Bottom 0.381: 73.05,22.55 73.71,23.21 77.8,23.21 79.01,24.43
  Bottom 0.406: R8.1 79.01,24.43 | 73.05,22.55 73.05,22.08 LED2.A
N$36
  Bottom 0.381: 81.33,24.4 80.35,23.42 78.8,23.42 78.03,22.66 75.95,22.66 75.59,22.3 74.77,22.3
  Bottom 0.406: R9.1 81.33,24.4 | 74.77,22.3 LED3.A
N$40
  Top 0.406: C89.1 25.27,13.3 24.9,12.93 24.85,12.93 R77.2 23.21,10.82 C88.2 23.14,9.93 25.43,7.64 26.19,7.64 IC16.P1
N$41
  Top 0.254: C83.2 24.97,28.09
  Top 0.305: C83.2 25.61,28.09 26.01,27.68 26.01,24.89 IC15.P8
  Top 0.406: R75.1 22.93,28.09 C83.2 24.71,30.55 C84.1
N$42
  Top 0.254: C89.2 25.28,15.44 26.19,14.53
  Top 0.305: 26.19,14.53 26.19,11.79 IC16.P8 | C90.1 25.28,17.34 C89.2
  Top 0.406: C89.2 23.81,15.65 R78.1
N$43
  Top 0.254: C82.2 23.17,23.7
  Top 0.305: IC15.P1 23.07,23.7 C82.2
  Top 0.406: C82.2 R74.2 | R74.2 | R74.2 24.25,25.93 C83.1
RESET  (via drill 0.35)
  Top 0.305: 56.85,19.94 D1.A 57.42,20.03 C16.1 | SJ1.2 56.85,19.94 | R1.1 58.9,17.89 56.85,19.94
  Top 0.406: C16.1 59.86,22.38 v62.74,22.38 64.54,22.38 66.46,24.29 66.46,29.3 J7.5
  Bottom 0.254: IC1.20 68.91,20.51
  Bottom 0.406: 68.91,20.51 71.22,20.51 C20.2 | IC1.20 67.4,20.51 65.53,22.38 v62.74,22.38
RX  (via drill 0.35)
  Top 0.305: 63.88,35.41 J7.4 | 63.88,35.41 63.51,35.41 | 53.47,33.62 53.47,33.58 v53.49,33.55 62.87,33.55 63.94,34.63 63.94,35.35 63.88,35.41
  Bottom 0.305: 55.67,30.66 55.67,24.75 IC1.2 | 55.67,30.66 R2.2 56.1,30.79 | v53.49,33.55 53.49,32.84 55.67,30.66
RXCAN
  Bottom 0.406: 68.64,11.63 IC1.31 73.99,11.71 74.32,11.38 74.32,9.38 IC2.4
SG5V  (via drill 0.35)
  Top 0.406: v50.44,24.08 50.44,24.59 51.46,25.6 51.46,33.48 50.95,33.98 31.36,33.98 v29.55,32.18 | v49.68,21.79 49.68,21.39 C10.1 50.16,20.4 IC7.VOUT
  Bottom 0.305: R30.1 30.98,18.68 30.17,19.48 30.17,21.47 30.86,22.16 R58.1
  Bottom 0.406: 30.77,12.74 R26.1 | 30.77,12.74 30.77,11.52 29.59,10.34 29.59,7.85 29.9,7.54 30.67,7.54 R19.1 30.68,6.45 29.57,5.33 29.57,4.01 R18.1 | 30.77,12.74 29.06,14.45 29.06,15.77 30.96,17.68 30.96,18.44 R30.1 | R58.1 30.74,23.47 29.87,24.33 29.87,26.11 30.63,26.87 30.63,28.75 R62.1 | 30.67,28.94 R62.1 | R62.1 30.31,28.79 29.55,29.55 v29.55,32.18 | v49.68,21.79 49.68,23.32 v50.44,24.08
SG_1
  Top 0.305: J2.B7 20.08,9.99 23.52,6.55 23.53,6.55 23.6,6.49 34.02,6.49 34.95,5.56 34.95,4.25 34.73,4.04 33.89,4.04 IC8.2
SG_2  (via drill 0.35)
  Top 0.254: 33.79,8.76 IC9.2
  Top 0.305: v29.11,11.89 34.19,11.89 34.95,11.12 34.95,9.09 34.62,8.76 33.81,8.76 | 33.81,8.76 33.8,8.75 33.81,8.76
  Top 0.406: J2.B13 19.67,11.49 v19.69,11.48 | 33.8,8.75 33.79,8.76
  Bottom 0.406: v19.69,11.48 28.7,11.48 v29.11,11.89
SG_3  (via drill 0.35)
  Top 0.305: J2.B5 19.46,17.67 v19.46,17.73 | IC10.2 34.04,14.3 34.98,14.3 35.2,14.53 35.2,15.7 33.97,16.93 29.91,16.93 v28.6,18.24
  Bottom 0.305: v19.46,17.73 28.09,17.73 v28.6,18.24
SG_4
  Top 0.305: J2.B4 28.85,18.99 29.62,19.76 29.62,21.28 30.38,22.05 34.44,22.05 35.05,21.44 35.05,20.14 34.76,19.85 34.68,19.85 34.67,19.84 IC11.2
SG_5  (via drill 0.35)
  Top 0.254: 33.89,25.02 IC12.2
  Top 0.305: IC12.2 33.94,25.09 34.79,25.09 34.98,25.29 34.98,25.95 34.69,26.23 33.23,26.23 33.22,26.22 30.47,26.22 29.58,25.34 29.58,25.31 29.11,24.84 v29.11,23.32 | J2.B10 24.51,20.49 v24.54,20.52
  Bottom 0.305: v24.54,20.52 27.33,23.32 v29.11,23.32
SG_6  (via drill 0.35)
  Top 0.305: v29.11,26.36 29.87,26.36 30.63,27.13 31.9,27.13 32.92,28.14 32.92,29.92 33.28,30.28 IC13.2
  Top 0.406: J2.B3 20.4,21.99 v20.42,21.97
  Bottom 0.305: v20.42,21.97 24.71,21.97 v29.11,26.36
SGO1  (via drill 0.35)
  Top 0.254: IC8.7 39.43,4.05 v39.45,4.04
  Bottom 0.254: R22.2 37.49,3.14 C35.1 41.28,3.1 | v39.45,4.04 40.45,4.04 C39.2
  Bottom 0.406: IC1.56 53.19,16.5 51.96,16.5 50.3,14.85 50.3,7.72 45.48,3.15 C39.2 41.28,3.1
SGO2  (via drill 0.35)
  Top 0.254: IC9.7 39.38,8.75 v39.4,8.76
  Bottom 0.254: R25.2 36.96,7.67 C40.1 | v39.4,8.76 40.12,8.76 C42.2
  Bottom 0.406: C40.1 40.92,7.59 C42.2 48.72,7.77 49.35,8.41 49.35,14.93 51.66,17.25 53.14,17.25 IC1.57
SGO3  (via drill 0.35)
  Top 0.254: IC10.7 39.51,14.32 v39.52,14.3
  Bottom 0.254: v39.52,14.3 39.95,14.3 C45.2 | R29.2 37.2,13.18 C43.1
  Bottom 0.406: C43.1 41.2,13.15 C45.2 47.91,13.09 48.54,13.72 48.54,15 51.61,18.07 53.16,18.07 IC1.58
SGO4  (via drill 0.35)
  Top 0.254: IC11.7 v39.34,19.84 | v39.34,19.84
  Bottom 0.254: v39.34,19.84 40.25,19.84 C48.2 | R33.2 37.32,18.89 C46.1
  Bottom 0.406: C46.1 41.02,18.83 C48.2 41.22,16.45 41.76,15.91 48.25,15.91 48.96,16.62 48.96,16.64 51.27,18.95 53.16,18.95 IC1.59
SGO5  (via drill 0.35)
  Top 0.254: IC12.7 39.34,25.08 v39.37,25.04
  Bottom 0.254: 40.64,24.99 C69.2 40.59,25.04 v39.37,25.04 | R61.2 37.1,23.87 C67.1
  Bottom 0.406: C67.1 40.38,23.97 C69.2 42.48,24.71 44.81,22.38 44.81,18.01 45.84,16.97 47.65,16.97 50.44,19.76 53.14,19.76 IC1.60
SGO6  (via drill 0.35)
  Top 0.254: IC13.7 39.52,30.28 v39.55,30.25
  Bottom 0.254: R65.2 37.16,29.35 C70.1 | v39.55,30.25 40.23,30.25 C72.2
  Bottom 0.406: C70.1 41.1,29.38 C72.2 43.43,29.33 44.6,28.16 44.6,25.86 45.36,25.09 45.36,18.24 45.62,17.98 47.4,17.98 49.81,20.4 49.81,20.42 53.11,20.42 IC1.61
TCI1+
  Top 0.406: J2.B2 19.18,24.99 20.07,25.88 21.06,25.88 R74.1
TCI1-
  Top 0.406: J2.B8 19.63,26.49 R75.2 21.16,29.78 R76.2
TCI2+
  Top 0.406: J2.B6 21.44,12.99 R77.1
TCI2-
  Top 0.406: J2.B12 20.96,14.49 R78.2 21.5,15.43 21.08,15.85 21.08,17.21 R79.2
TCO1  (via drill 0.35)
  Top 0.305: v28.09,26.62 27.84,26.62 27.33,26.11 27.33,24.91 IC15.P6 IC15.P5 28.43,24.39 28.43,23.03 28.85,22.61 34.46,22.61 | 34.47,22.61 34.46,22.61 | 34.46,22.61 35.4,22.61 v35.97,22.05 | 53.4,16.84 53.38,16.86 53.75,16.86 | v55.02,15.95 55.02,16.65 54.81,16.86 53.75,16.86 | v39.01,22.06 42.81,22.06 45.11,19.76 45.11,17.47 45.73,16.86 53.75,16.86
  Bottom 0.305: v35.97,22.05 39,22.05 v39.01,22.06 | IC1.55 53.21,15.7 54.25,15.7 54.51,15.95 v55.02,15.95
TCO2  (via drill 0.35)
  Top 0.254: IC16.P6 IC16.P5
  Top 0.406: IC16.P5 28.19,11.77 28.8,11.15 31.37,11.15 v31.41,11.11 | v54.76,14.93 54.76,12.65 51.86,9.75 v48.41,9.75
  Bottom 0.406: IC1.54 54.73,14.91 v54.76,14.93 | v31.41,11.11 31.82,11.11 32.82,12.11 46.15,12.11 48.41,9.85 v48.41,9.75
TX  (via drill 0.35)
  Top 0.305: J7.1 59.59,29.31 59.56,29.29 v59.46,29.29
  Bottom 0.305: IC1.3 56.57,25.83 57.95,27.21 R7.2 59.46,29.33 v59.46,29.29
TXCAN
  Bottom 0.406: 68.7,12.52 IC1.30 67.57,12.51 67.21,12.14 67.21,10.62 67.97,9.85 69.75,9.85 70.36,9.25 IC2.1
VCC  (via drill 0.35)
  Top 0.254: IC16.P7 26.86,12.59 28.91,14.63 28.91,15.29 | 38.09,20.49 IC11.8 | 38.51,30.93 IC13.8 | 38.51,30.93 40.81,30.93 C71.1 | C41.1 40.82,9.6 39.01,9.6 38.81,9.4 IC9.8 | 38.11,14.96 IC10.8 38.16,14.93 38.76,14.93 39.27,15.44 40.21,15.44 C44.1 | 37.99,20.47 IC11.8 | 38.03,25.7 IC12.8 | 38.49,30.91 38.51,30.93 | C36.1 40.87,4.7 38,4.7 IC8.8 37.91,4.77 | C47.1 40.08,20.04 39.62,20.49 38.35,20.49 38.34,20.49 IC11.8
  Top 0.305: v51.41,8.15 53.04,8.15 IC6.2 | 58.64,25.22 L1.1 | C79.1 26.66,26.2 26.64,26.18 IC15.P7 | 28.9,15.59 C85.1 28.9,15.29 28.91,15.29 | IC12.8 40.72,25.73 C68.1
  Top 0.406: IC6.4 54.13,6.59 IC6.2 | v58.83,36.02 59.43,35.41 J7.2 | J2.B9 J2.B15 11.28,23.49 J2.B22 11.28,20.49 | C85.1 29.78,15.35 v30.38,15.95 | v28.6,31.7 28.6,28.14 C79.1 | IC6.4 46.17,6.59 v46.05,6.59 | C36.1 40.63,4.68 | J1.P$1 85.03,13.96 v84.73,13.66 | L1.1 58.61,25.39 v60.35,27.13 | D1.C 61.86,20.03 v63.4,18.49 60.9,15.99 R1.2 | R6.2 55.75,2.2 v55.52,1.98 | IC6.4 48.57,8.69 v48.41,8.84 | IC6.4 48.57,7.61 v47.42,8.76 | IC6.4 48.16,6.59 47.03,5.46 46.27,5.46 v46.25,5.47 | IC6.4 48.67,6.59 50.71,4.55 50.71,3.52 v50.7,3.5 | v37.74,27.63 37.74,25.99 38.03,25.7 | v37.96,22.73 37.96,20.5 37.99,20.47 | v36.98,17.22 36.98,16.81 38.23,15.57 38.23,15.07 IC10.8 | v37.49,11.12 37.49,9.78 IC9.8 | v38.76,6.3 38.76,5.46 38,4.7 | J2.B16 11.28,20.49 | 11.28,20.49 J2.B23 | IC6.4 48.57,3.61 50.19,1.98 C24.1 | C24.1 | C71.1 40.52,30.96 v39.52,31.95
  Top 0.508: 54.36,6.82 IC6.2
  Top 0.61: 61.6,35.41 J7.2 | C79.1 28.75,28.29
  Bottom 0.254: C19.1 81.91,28.69 81.94,28.65
  Bottom 0.305: IC1.52 52.65,13.31 51.38,12.04 51.38,8.14 51.44,8.09 51.44,8.13 v51.41,8.15 | 74.22,26.43 IC5.20 IC5.19 | 81.98,28.71 81.94,28.75 | 70.89,33.66 IC5.4 70.92,34.65 v72.03,35.76 | IC5.19 | IC5.19 74.82,25.61 75.21,25.22 75.72,25.22 v75.84,25.09 | v83.72,26.11 82.13,26.11 R9.2
  Bottom 0.406: R8.2 81.91,26.33 R9.2 81.94,28.65 81.94,28.75 C19.1 84.11,28.78 v84.23,28.9 | IC1.21 64.61,19.71 v63.4,18.49 | IC1.52 56.18,13.31 v57.56,14.68 | IC2.3 72.91,6.44 73.81,5.54 83.46,5.54 84.73,6.81 v84.73,13.66
  pour Route11 (isolate 0.305): 6.72,38.8 90.79,38.8 90.84,38.75 90.84,-0.83 6.85,-0.83
VCC3O
  Bottom 0.305: C18.1 76.94,28.43 76.11,27.61 IC5.17
XTAL1
  Bottom 0.406: Q1.2 72.59,19.25 71.42,18.08 68.74,18.08 IC1.23
  Bottom 0.61: Q1.2 80.05,19.25 C2.2

### Text on the board
tNames: 2018 CAN Board - Strain Gauge